# Altium schematic sheet Motorcontroller.SchDoc
size A4; SheetNumber: 1; SheetTotal: 2
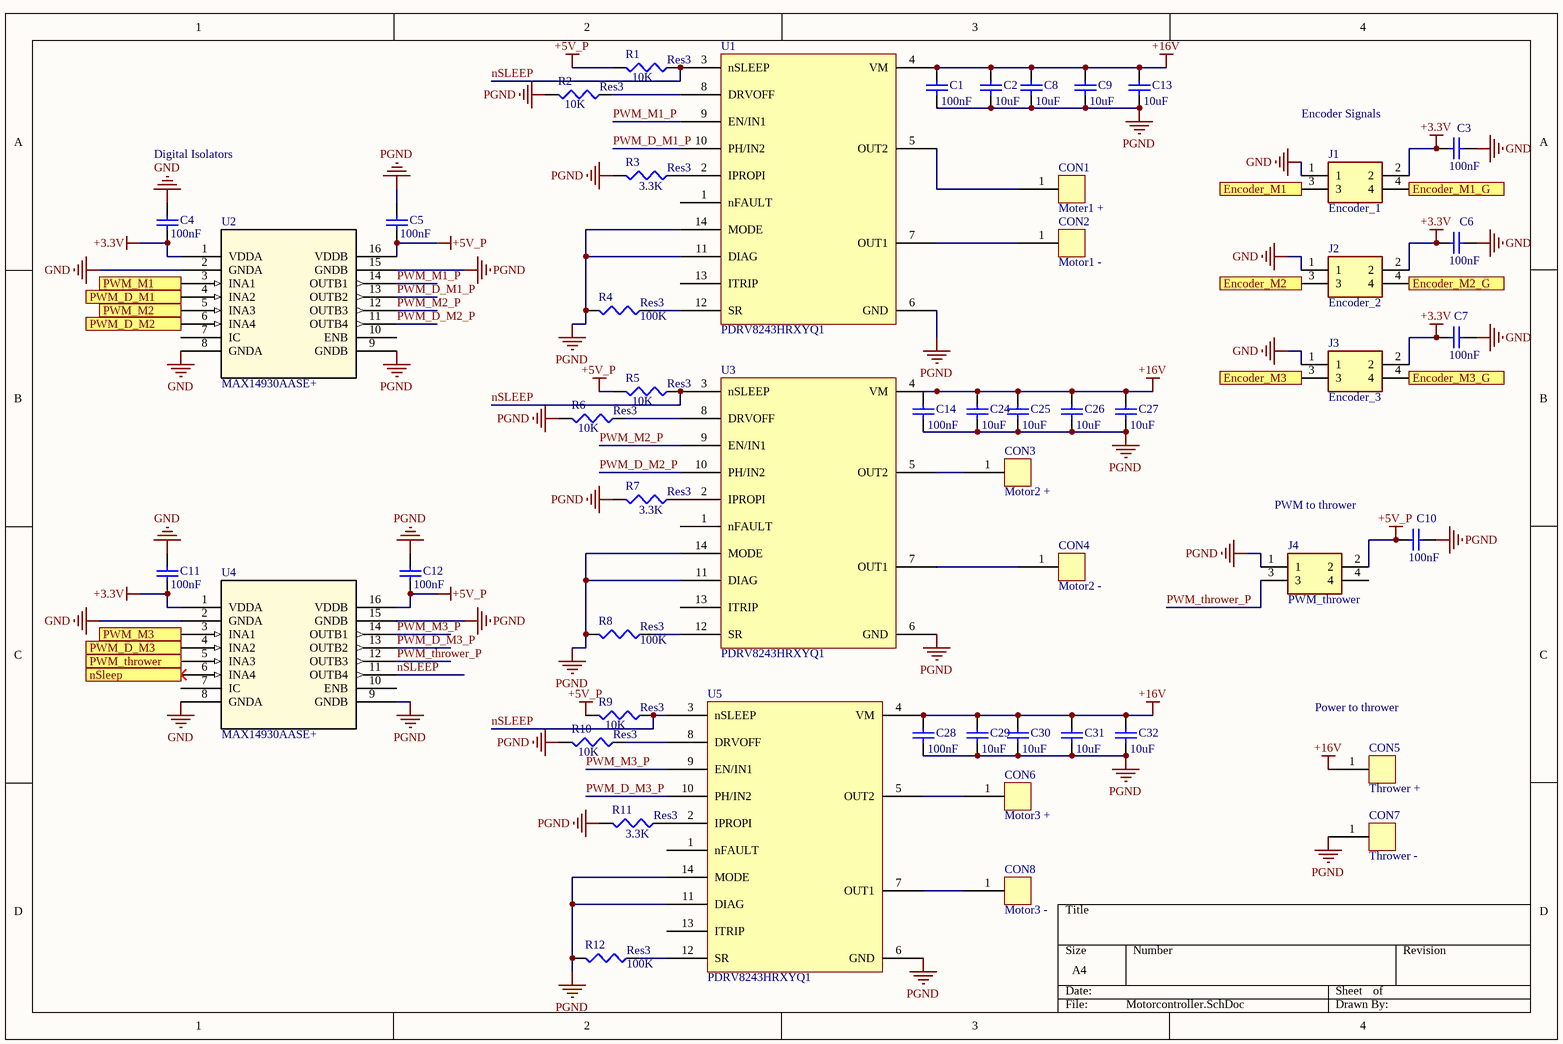
[diagram p0: Motorcontroller.SchDoc]

## Parts
C1  value 100nF  [1608[0603]]  (hidden comment: Cap Semi)
C2  value 10uF  [C1206]  (hidden comment: Cap Semi)
C3  value 100nF  [1608[0603]]  (hidden comment: Cap Semi)
C4  value 100nF  [1608[0603]]  (hidden comment: Cap Semi)
C5  value 100nF  [1608[0603]]  (hidden comment: Cap Semi)
C6  value 100nF  [1608[0603]]  (hidden comment: Cap Semi)
C7  value 100nF  [1608[0603]]  (hidden comment: Cap Semi)
C8  value 10uF  [C1206]  (hidden comment: Cap Semi)
C9  value 10uF  [C1206]  (hidden comment: Cap Semi)
C10  value 100nF  [1608[0603]]  (hidden comment: Cap Semi)
C11  value 100nF  [1608[0603]]  (hidden comment: Cap Semi)
C12  value 100nF  [1608[0603]]  (hidden comment: Cap Semi)
C13  value 10uF  [C1206]  (hidden comment: Cap Semi)
C14  value 100nF  [1608[0603]]  (hidden comment: Cap Semi)
C24  value 10uF  [C1206]  (hidden comment: Cap Semi)
C25  value 10uF  [C1206]  (hidden comment: Cap Semi)
C26  value 10uF  [C1206]  (hidden comment: Cap Semi)
C27  value 10uF  [C1206]  (hidden comment: Cap Semi)
C28  value 100nF  [1608[0603]]  (hidden comment: Cap Semi)
C29  value 10uF  [C1206]  (hidden comment: Cap Semi)
C30  value 10uF  [C1206]  (hidden comment: Cap Semi)
C31  value 10uF  [C1206]  (hidden comment: Cap Semi)
C32  value 10uF  [C1206]  (hidden comment: Cap Semi)
CON1  Moter1 +  [con_soldering]
CON2  Motor1 -  [con_soldering]
CON3  Motor2 +  [con_soldering]
CON4  Motor2 -  [con_soldering]
CON5  Thrower +  [con_soldering]
CON6  Motor3 +  [con_soldering]
CON7  Thrower -  [con_soldering]
CON8  Motor3 -  [con_soldering]
J1  Encoder_1  [TE_7-215079-4]
J2  Encoder_2  [TE_7-215079-4]
J3  Encoder_3  [TE_7-215079-4]
J4  PWM_thrower  [TE_7-215079-4]
R1  Res3  value 10K  [J1-0603]
R2  Res3  value 10K  [J1-0603]
R3  Res3  value 3.3K  [J1-0603]
R4  Res3  value 100K  [J1-0603]
R5  Res3  value 10K  [J1-0603]
R6  Res3  value 10K  [J1-0603]
R7  Res3  value 3.3K  [J1-0603]
R8  Res3  value 100K  [J1-0603]
R9  Res3  value 10K  [J1-0603]
R10  Res3  value 10K  [J1-0603]
R11  Res3  value 3.3K  [J1-0603]
R12  Res3  value 100K  [J1-0603]
U1  PDRV8243HRXYQ1  [DRV8243_motor_driver]
U2  MAX14930AASE+  [21-0041_S16+1_MXM]
U3  PDRV8243HRXYQ1  [DRV8243_motor_driver]
U4  MAX14930AASE+  [21-0041_S16+1_MXM]
U5  PDRV8243HRXYQ1  [DRV8243_motor_driver]

## Ports
Encoder_M1 (out), Encoder_M1_G (out), Encoder_M2 (out), Encoder_M2_G (out), Encoder_M3 (out), Encoder_M3_G (out), nSleep (in), PWM_D_M1 (in), PWM_D_M2 (in), PWM_D_M3 (in), PWM_M1 (in), PWM_M2 (in), PWM_M3 (in), PWM_thrower (in)

## Nets
+3.3V: C3.2 C4.2 C6.2 C7.2 C11.2 J1.2 J2.2 J3.2 U2.1(VDDA) U4.1(VDDA)
+5V_P: C5.2 C10.2 C12.2 J4.2 R1.2 R5.2 R9.2 U2.16(VDDB) U4.16(VDDB)
+16V: C1.2 C2.2 C8.2 C9.2 C13.2 C14.2 C24.2 C25.2 C26.2 C27.2 C28.2 C29.2 C30.2 C31.2 C32.2 CON5.1 U1.4(VM) U3.4(VM) U5.4(VM)
GND: C3.1 C4.1 C6.1 C7.1 C11.1 J1.1 J2.1 J3.1 U2.2(GNDA) U2.8(GNDA) U4.2(GNDA) U4.8(GNDA)
PGND: C1.1 C2.1 C5.1 C8.1 C9.1 C10.1 C12.1 C13.1 C14.1 C24.1 C25.1 C26.1 C27.1 C28.1 C29.1 C30.1 C31.1 C32.1 CON7.1 J4.1 R2.2 R3.2 R4.2 R6.2 R7.2 R8.2 R10.2 R11.2 R12.2 U1.6(GND) U1.11(DIAG) U1.14(MODE) U2.9(GNDB) U2.15(GNDB) U3.6(GND) U3.11(DIAG) U3.14(MODE) U4.9(GNDB) U4.15(GNDB) U5.6(GND) U5.11(DIAG) U5.14(MODE)
Encoder_M1: J1.3 ; port Encoder_M1
Encoder_M1_G: J1.4 ; port Encoder_M1_G
Encoder_M2: J2.3 ; port Encoder_M2
Encoder_M2_G: J2.4 ; port Encoder_M2_G
Encoder_M3: J3.3 ; port Encoder_M3
Encoder_M3_G: J3.4 ; port Encoder_M3_G
nSLEEP: R1.1 R5.1 R9.1 U1.3(nSLEEP) U3.3(nSLEEP) U4.11(OUTB4) U5.3(nSLEEP)
nSleep: U4.6(INA4) ; port nSleep  [a separate net that carries the same name]
PWM_D_M1: U2.4(INA2) ; port PWM_D_M1
PWM_D_M1_P: U1.10(PH/IN2) U2.13(OUTB2)
PWM_D_M2: U2.6(INA4) ; port PWM_D_M2
PWM_D_M2_P: U2.11(OUTB4) U3.10(PH/IN2)
PWM_D_M3: U4.4(INA2) ; port PWM_D_M3
PWM_D_M3_P: U4.13(OUTB2) U5.10(PH/IN2)
PWM_M1: U2.3(INA1) ; port PWM_M1
PWM_M1_P: U1.9(EN/IN1) U2.14(OUTB1)
PWM_M2: U2.5(INA3) ; port PWM_M2
PWM_M2_P: U2.12(OUTB3) U3.9(EN/IN1)
PWM_M3: U4.3(INA1) ; port PWM_M3
PWM_M3_P: U4.14(OUTB1) U5.9(EN/IN1)
PWM_thrower: U4.5(INA3) ; port PWM_thrower
PWM_thrower_P: J4.3 U4.12(OUTB3)
NetCON1_1: CON1.1 U1.5(OUT2)
NetCON2_1: CON2.1 U1.7(OUT1)
NetCON3_1: CON3.1 U3.5(OUT2)
NetCON4_1: CON4.1 U3.7(OUT1)
NetCON6_1: CON6.1 U5.5(OUT2)
NetCON8_1: CON8.1 U5.7(OUT1)
NetR2_1: R2.1 U1.8(DRVOFF)
NetR3_1: R3.1 U1.2(IPROPI)
NetR4_1: R4.1 U1.12(SR)
NetR6_1: R6.1 U3.8(DRVOFF)
NetR7_1: R7.1 U3.2(IPROPI)
NetR8_1: R8.1 U3.12(SR)
NetR10_1: R10.1 U5.8(DRVOFF)
NetR11_1: R11.1 U5.2(IPROPI)
NetR12_1: R12.1 U5.12(SR)

Not connected (* = marked no-connect by the designer): J4 4; U1 1(nFAULT) 13(ITRIP); U2 7(IC) 10(ENB); U3 1(nFAULT) 13(ITRIP); U4 7(IC) 10(ENB); U5 1(nFAULT) 13(ITRIP)

## Notes on the sheet
- Encoder Signals
- Digital Isolators
- PWM to thrower
- Power to thrower

## Library data of the parts
C1-C14 C24-C32 = Cap Semi: Capacitor (Semiconductor SIM Model); Published: 8-Jun-2000; LatestRevisionDate: 29-May-2009; LatestRevisionNote: IPC-7351 Footprint Added.; PackageReference: C1206; Publisher: Altium Limited; PackageDescription: Chip Capacitor
CON1-CON8 = Con_soldering
J1-J4 = Con_4_encoder: Micro-MaTch 4 Position 1.27 mm Pitch Vertical Female-on-Board Connector; MP: 7-215079-4; MF: TE Connectivity; Value: *; SnapEDA_Link: https://www.snapeda.com/parts/7-215079-4/TE%20Connectivity%20AMP%20Connectors/view-part/453401/?ref=snap; Price: None; Package: SMD-6; Availability: Unavailable
R1-R12 = Res3: Resistor; Published: 8-Jun-2000; LatestRevisionDate: 29-May-2009; LatestRevisionNote: IPC-7351 Footprint Added.; PackageReference: J1-0603; Publisher: Altium Limited; PackageDescription: Chip Resistor
U2 U4 = MAX14930AASE+: No Description Available; Mfr_Name: Maxim Integrated Products; Copyright: Copyright (C) 2021 Ultra Librarian. All rights reserved.; Manufacturer_Part_Number: MAX14930AASE+; RefDes: RefDes; Type: DEV